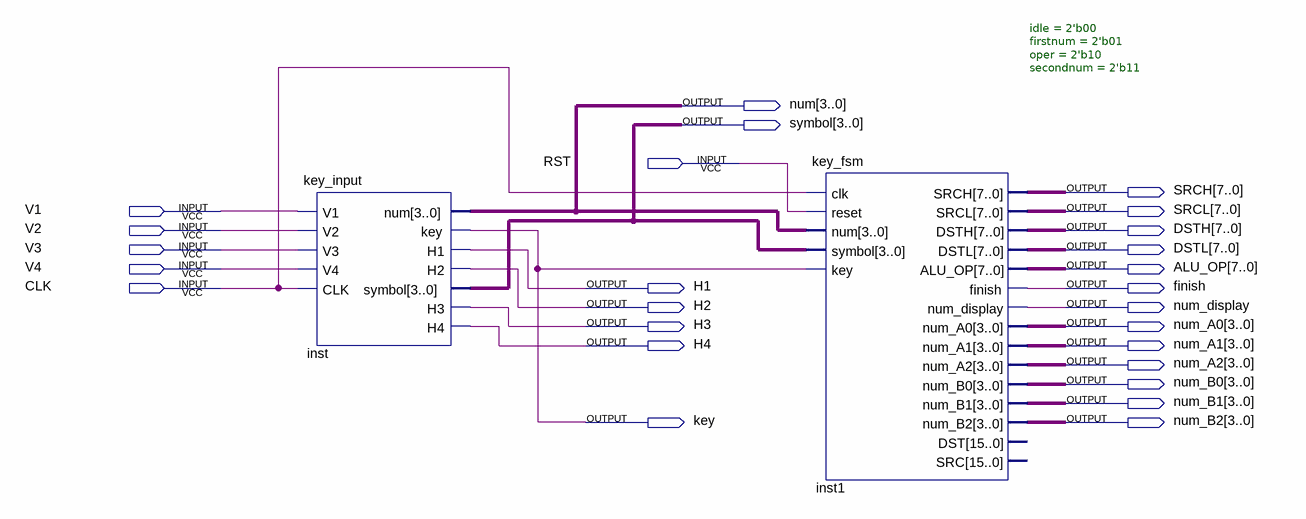
[diagram p0: schematic sheet]
// Quartus schematic key_scan.bdf as structural Verilog: 2 symbols, 26 pins
module key_scan (
  input  RST,
  input  V1,
  input  V2,
  input  V3,
  input  V4,
  input  CLK,
  output [3:0] num,
  output [3:0] symbol,
  output [7:0] SRCH,
  output [7:0] SRCL,
  output [7:0] DSTH,
  output [7:0] DSTL,
  output [7:0] ALU_OP,
  output H1,
  output finish,
  output H2,
  output num_display,
  output H3,
  output [3:0] num_A0,
  output H4,
  output [3:0] num_A1,
  output [3:0] num_A2,
  output [3:0] num_B0,
  output [3:0] num_B1,
  output key,
  output [3:0] num_B2
);

  key_input inst (
    .V1(V1), .V2(V2), .V3(V3), .V4(V4), .CLK(CLK), .num(num), .key(key), .H1(H1), .H2(H2), .symbol(symbol),
    .H3(H3), .H4(H4));
  key_fsm #(.idle(2'b00), .firstnum(2'b01), .oper(2'b10), .secondnum(2'b11)) inst1 (
    .clk(CLK), .reset(RST), .num(num), .symbol(symbol), .key(key), .SRCH(SRCH), .SRCL(SRCL), .DSTH(DSTH),
    .DSTL(DSTL), .ALU_OP(ALU_OP), .finish(finish), .num_display(num_display), .num_A0(num_A0),
    .num_A1(num_A1), .num_A2(num_A2), .num_B0(num_B0), .num_B1(num_B1), .num_B2(num_B2));  // open: DST, SRC
endmodule
